# EAGLE design LRTrobo (EAGLE 9.6.1)
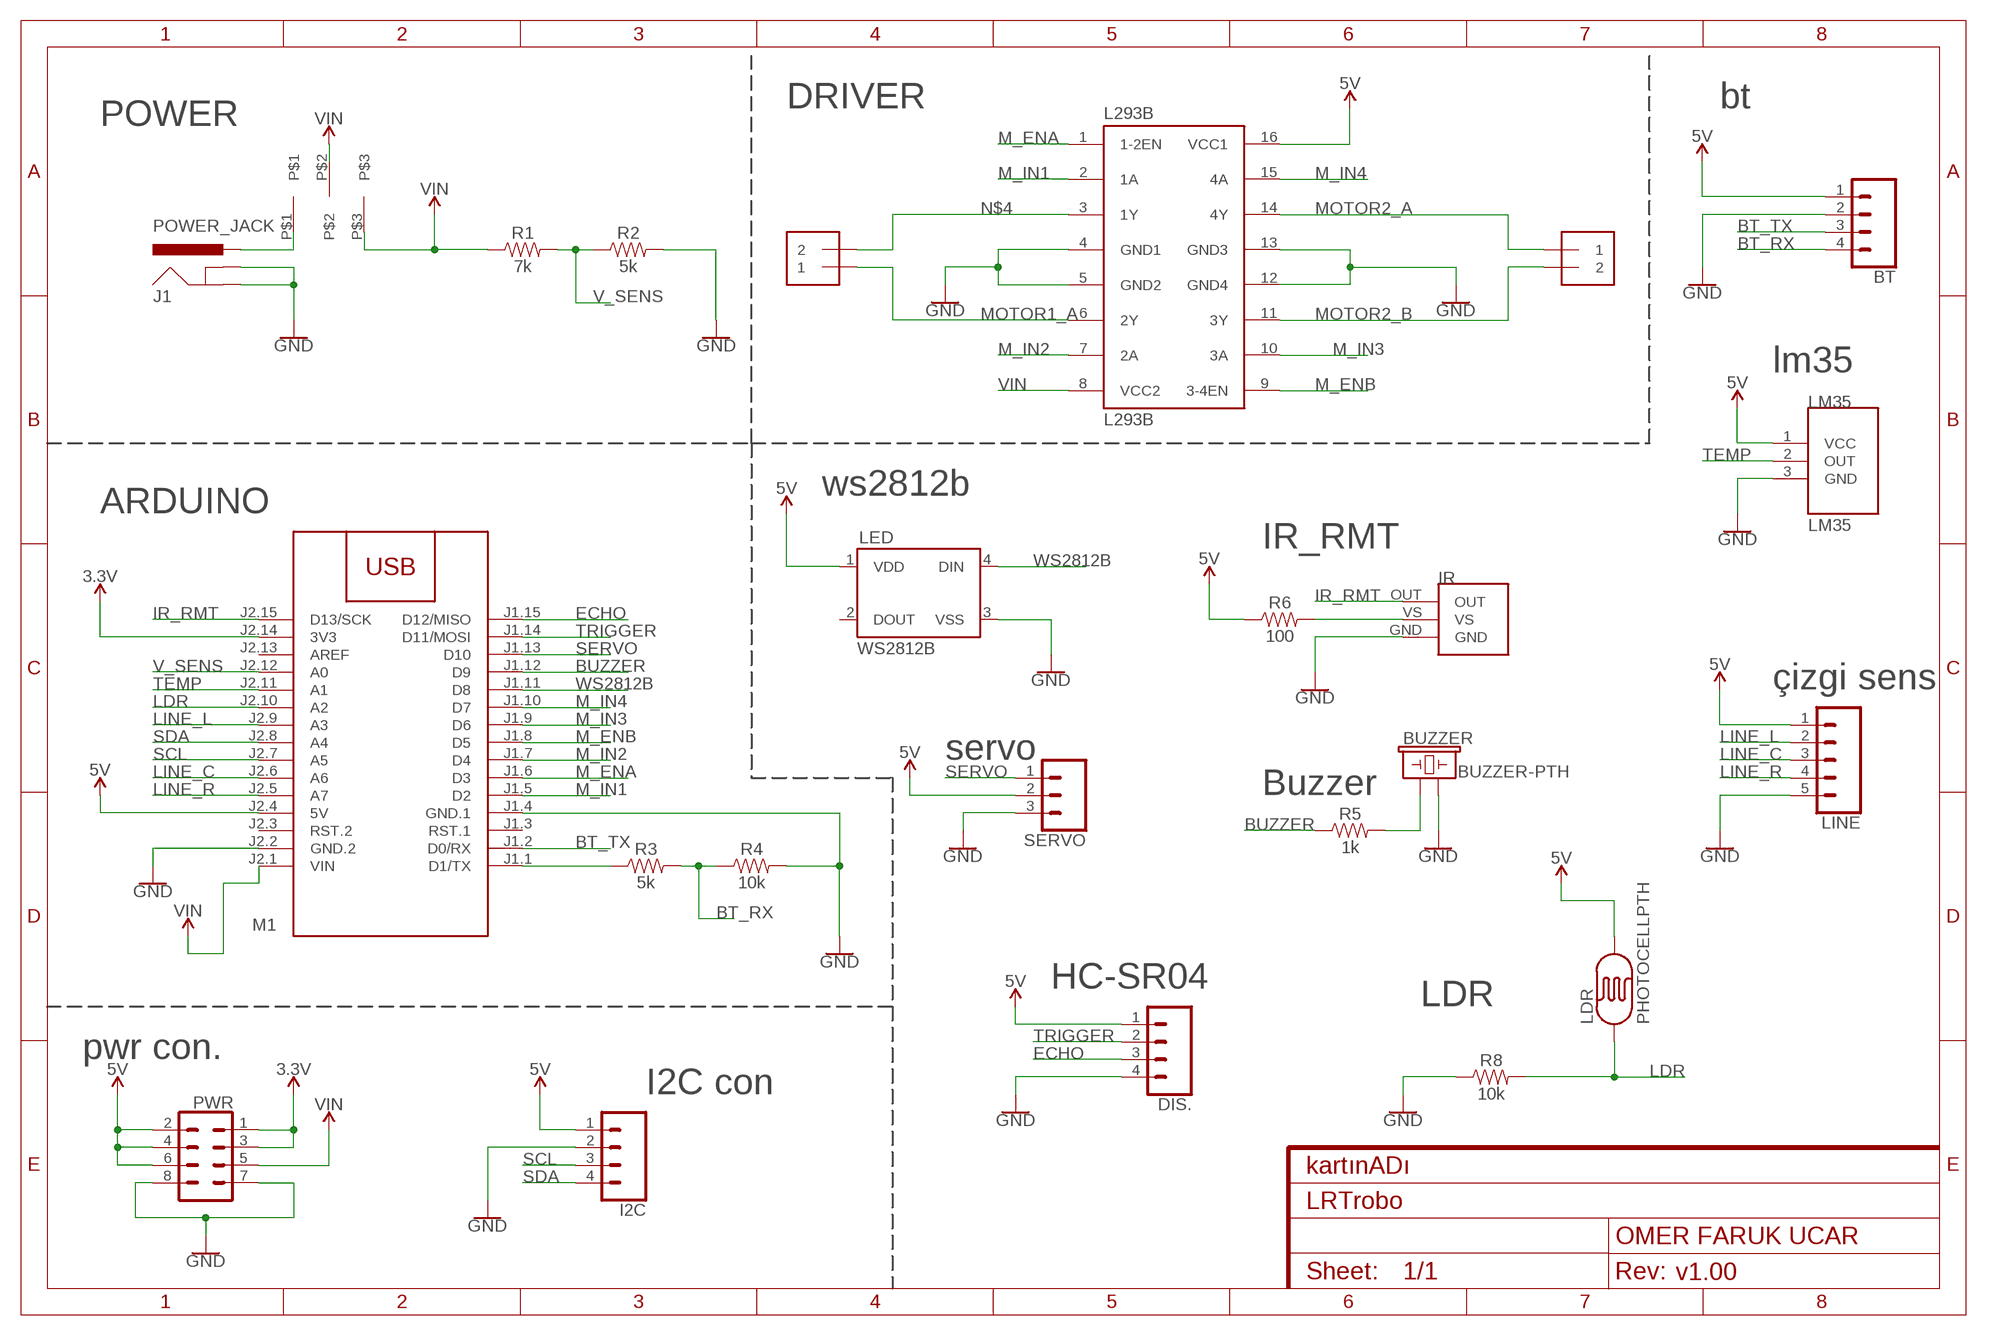
[diagram p0: schematic, sheet 1]
FRAME1 (FRAME-A4L): CNAME: kartınADı; CREVISION: v1.00; DESIGNER: OMER FARUK UCAR

## Parts
BT  CONN_04  [1X04]
BUZZER  BUZZER-PTH  [BUZZER-12MM]
DIS.  CONN_04  [1X04]
I2C  CONN_04  [1X04]
IR  TSOP2238THT  [TSOP2238]
J1  POWER_JACK  [POWER_JACK_PTH]
L293B  L293B  L293D  [DIL16]
LDR  PHOTOCELLPTH  [PHOTOCELL]
LED  WS2812B  [WS2812B]
LINE  CONN_05  [1X05]
LM35  LM35  [TO-92]
M1  ARDUINO-NANO  [ARDUINO-NANO]
MPOWER  1X2-3.5MM  [1X2-3.5MM]
MPOWER1  1X2-3.5MM  [1X2-3.5MM]
PWR  CONN_04X2  [2X4]
R1  7k  1KOHM-HORIZ-1/4W-5%  [AXIAL-0.3]
R2  5k  1KOHM-HORIZ-1/4W-5%  [AXIAL-0.3]
R3  5k  1KOHM-HORIZ-1/4W-5%  [AXIAL-0.3]
R4  10k  1KOHM-HORIZ-1/4W-5%  [AXIAL-0.3]
R5  1k  1KOHM-HORIZ-1/4W-5%  [AXIAL-0.3]
R6  100  1KOHM-HORIZ-1/4W-5%  [AXIAL-0.3]
R8  10k  1KOHM-HORIZ-1/4W-5%  [AXIAL-0.3]
SERVO  CONN_03  [1X03]
SW1  SW1  [SW1]

## Nets
3.3V: M1.J2.14(3V3) PWR.1 PWR.3
5V: BT.1 DIS..1 I2C.1 L293B.16(VCC1) LDR.2 LED.1(VDD) LINE.1 LM35.1(VCC) M1.J2.4(5V) PWR.2 PWR.4 PWR.6 R6.P$1 SERVO.2
BT_RX: BT.4 R3.P$2 R4.P$1
BT_TX: BT.3 M1.J1.2(D0/RX)
BUZZER: M1.J1.12(D9) R5.P$1
ECHO: DIS..3 M1.J1.15(D12/MISO)
GND: BT.2 BUZZER.- DIS..4 I2C.2 IR.GND J1.GND J1.GNDBREAK L293B.4(GND1) L293B.5(GND2) L293B.12(GND4) L293B.13(GND3) LED.3(VSS) LINE.5 LM35.3(GND) M1.J1.4(GND.1) M1.J2.2(GND.2) PWR.7 PWR.8 R2.P$2 R4.P$2 R8.P$1 SERVO.3
IR_RMT: IR.OUT M1.J2.15(D13/SCK)
LDR: LDR.1 M1.J2.10(A2) R8.P$2
LINE_C: LINE.3 M1.J2.6(A6)
LINE_L: LINE.2 M1.J2.9(A3)
LINE_R: LINE.4 M1.J2.5(A7)
M_ENA: L293B.1(1-2EN) M1.J1.6(D3)
M_ENB: L293B.9(3-4EN) M1.J1.8(D5)
M_IN1: L293B.2(1A) M1.J1.5(D2)
M_IN2: L293B.7(2A) M1.J1.7(D4)
M_IN3: L293B.10(3A) M1.J1.9(D6)
M_IN4: L293B.15(4A) M1.J1.10(D7)
MOTOR1_A: L293B.6(2Y) MPOWER.1
MOTOR2_A: L293B.14(4Y) MPOWER1.1
MOTOR2_B: L293B.11(3Y) MPOWER1.2
N$1: M1.J1.1(D1/TX) R3.P$1
N$2: BUZZER.+ R5.P$2
N$3: IR.VS R6.P$2
N$4: L293B.3(1Y) MPOWER.2
N$5: J1.PWR SW1.P$1
SCL: I2C.3 M1.J2.7(A5)
SDA: I2C.4 M1.J2.8(A4)
SERVO: M1.J1.13(D10) SERVO.1
TEMP: LM35.2(OUT) M1.J2.11(A1)
TRIGGER: DIS..2 M1.J1.14(D11/MOSI)
V_SENS: M1.J2.12(A0) R1.P$2 R2.P$1
VIN: L293B.8(VCC2) M1.J2.1(VIN) PWR.5 R1.P$1 SW1.P$2 SW1.P$3
WS2812B: LED.4(DIN) M1.J1.11(D8)
Unconnected: LED.2(DOUT) M1.J1.3(RST.1) M1.J2.3(RST.2) M1.J2.13(AREF)

## Notes on the sheet
- DRIVER | bt
- POWER
- lm35
- ws2812b
- ARDUINO
- IR_RMT
- çizgi sens
- servo
- Buzzer
- HC-SR04
- LDR
- pwr con.
- I2C con

## Library data of the parts
BT DIS. I2C = SparkFun-Connectors:CONN_04: Multi connection point. Often used as Generic Header-pin footprint for 0.1 inch spaced/style header connections On any of the 0.1 inch spaced packages, you can populate with these: Break Away Headers - Straight <https://www.sparkfun.com/products/116> (PRT-00116) Break Away Male Headers - Right Angle <https://www.sparkfun.com/products/553> (PRT-00553) Female Headers <https://www.sparkfun.com/products/115> (PRT-00115) Break Away Headers - Machine Pin <https://www.sparkfun.com/products/117> (PRT-00117) Break Away Female Headers - Swiss Machine Pin <https://www.sparkfun.com/products/743> (PRT-00743) For SCREWTERMINALS and SPRING TERMINALS visit here: Screw Terimnals on SparkFun.com <https://www.sparkfun.com/search/results?term=Screw+Terminals> (5mm/3.5mm/2.54mm spacing) This device is also useful as a general connection point to wire up your design to another part of your project. Our various solder wires solder well into these plated through hole pads. Hook-Up Wire - Assortment (Stranded, 22 AWG) <https://www.sparkfun.com/products/11375> (PRT-11375) Hook-Up Wire - Assortment (Solid Core, 22 AWG) <https://www.sparkfun.com/products/11367> (PRT-11367) View the entire wire category on our website here <https://www.sparkfun.com/categories/141> Special notes: Molex polarized connector foot print use with SKU : PRT-08231 with associated crimp pins and housings. 1MM SMD Version SKU: PRT-10208; PROD_ID: CONN-09696
BUZZER = SparkFun-Electromechanical:BUZZER: Buzzer Small round buzzers that operate around the audible 2kHz range. You can use these as speakers to create simple music or user interfaces. Variant Overview: PTH - Mini Speaker - PC Mount 12mm 2.048kHz <https://www.sparkfun.com/products/7950> PTH_KIT - Mini Speaker - PC Mount 12mm 2.048kHz <https://www.sparkfun.com/products/7950> KIT simplifies soldering by adding stop mask to one side of the pads. PTH_NO_SILK - Mini Speaker - PC Mount 12mm 2.048kHz <https://www.sparkfun.com/products/7950> No silkscreen indicator of buzzer outline. PTH_KIT_NO_SILK - Mini Speaker - PC Mount 12mm 2.048kHz <https://www.sparkfun.com/products/7950> KIT package w/o silkscreen SMD - Buzzer Audio Magnetic (CCV-084B16) SMD buzzer used on, e.g. the LilyPad Buzzer <https://www.sparkfun.com/products/8463> and RFID USB Reader <https://www.sparkfun.com/products/9963>. SMD_KIT - Buzzer Audio Magnetic (CCV-084B16) SMD Buzzer with elongated pins to make soldering easier. Used on the SparkFun Simon Says - Surface Mount Soldering Kit <https://www.sparkfun.com/products/10935>.; PROD_ID: COMP-08253; SF_SKU: COM-07950
IR = OmerFarukUcar-Sensors:TSOP2238: TSOP2238 Device Created Date: 12.02.2020 Datasheet: https://cdn.ozdisan.com/ETicaret_Dosya/38875_1350615.pdf
J1 = SparkFun-Connectors:POWER_JACK: Power Jack Connector This is the standard 5.5mm barrel jack for power. The PTH is the most common, proven, reliable, footprint. The Slot footprint only works if the mill layer is transmitted to the PCB fab house so be warned. Here are the connectors we sell at SparkFun: DC Barrel Power Jack/Connector <https://www.sparkfun.com/products/119> (PRT-00119) DC Barrel Power Jack/Connector (SMD) <https://www.sparkfun.com/products/12748> (PRT-12748) DC Barrel Jack Adapter - Breadboard Compatible <https://www.sparkfun.com/products/10811> (PRT-10811) It is used on this SparkFun product (and many, many others): SparkFun RedBoard - Programmed with Arduino <https://www.sparkfun.com/products/12757> (DEV-12757) Also, if you need a mating power supply or connector, please check these out: Wall Adapter Power Supply - 9VDC 650mA <https://www.sparkfun.com/products/298> (TOL-00298) DC Barrel Jack Adapter - Male <https://www.sparkfun.com/products/10287> (PRT-10287); PROD_ID: CONN-08197
L293B = st-microelectronics:L293D: PUSH-PULL 4 CHANNEL DRIVER; MPN: L293D; OC_FARNELL: 9589619; OC_NEWARK: 56P8249
LDR = SparkFun:PHOTOCELL: Photocell Also known as a CdS photoresistor. This is a low cost way to detect light levels. Resistance decreases with more incoming light. SparkFun SKU: SEN-09088
LED = SparkFun-LED:WS2812B: WS2812B - Intelligent control LED integrated light source Technical Specifications: Power Supply Voltage (VDD): 3.5 to 5.3 V Input Voltage (VI): -0.5 to VDD+0.5 V Operating Junction Temperature (Topt): -25°C to +80°C Storage Temperature Range (Tstg): -55°C to +150°C; PROD_ID: DIO-12503
LINE = SparkFun-Connectors:CONN_05: Multi connection point. Often used as Generic Header-pin footprint for 0.1 inch spaced/style header connections On any of the 0.1 inch spaced packages, you can populate with these: Break Away Headers - Straight <https://www.sparkfun.com/products/116> (PRT-00116) Break Away Male Headers - Right Angle <https://www.sparkfun.com/products/553> (PRT-00553) Female Headers <https://www.sparkfun.com/products/115> (PRT-00115) Break Away Headers - Machine Pin <https://www.sparkfun.com/products/117> (PRT-00117) Break Away Female Headers - Swiss Machine Pin <https://www.sparkfun.com/products/743> (PRT-00743) For SCREWTERMINALS and SPRING TERMINALS visit here: Screw Terimnals on SparkFun.com <https://www.sparkfun.com/search/results?term=Screw+Terminals> (5mm/3.5mm/2.54mm spacing) This device is also useful as a general connection point to wire up your design to another part of your project. Our various solder wires solder well into these plated through hole pads. Hook-Up Wire - Assortment (Stranded, 22 AWG) <https://www.sparkfun.com/products/11375> (PRT-11375) Hook-Up Wire - Assortment (Solid Core, 22 AWG) <https://www.sparkfun.com/products/11367> (PRT-11367) View the entire wire category on our website here <https://www.sparkfun.com/categories/141> Special notes: Molex polarized connector foot print use with SKU : PRT-08231 with associated crimp pins and housings. 1MM SMD Version SKU: PRT-10208
LM35 = LezzetliRobotTarifleriLib:LM35
M1 = OmerFaruk-CPUBoards:ARDUINO-NANO: Arduino Nano 3.0
MPOWER MPOWER1 = adafruit:1X2: 3.5mm Terminal block http://www.ladyada.net/library/pcb/eaglelibrary.html
PWR = SparkFun-Connectors:CONN_04X2: Multi connection point. Often used as Generic Header-pin footprint for 0.1 inch spaced/style header connections On any of the 0.1 inch spaced packages, you can populate with these: Break Away Headers - Straight <https://www.sparkfun.com/products/116> (PRT-00116) Break Away Male Headers - Right Angle <https://www.sparkfun.com/products/553> (PRT-00553) Female Headers <https://www.sparkfun.com/products/115> (PRT-00115) Break Away Headers - Machine Pin <https://www.sparkfun.com/products/117> (PRT-00117) Break Away Female Headers - Swiss Machine Pin <https://www.sparkfun.com/products/743> (PRT-00743)
R1-R4 R6 R8 = SparkFun-Resistors:1KOHM: 1kΩ resistor A resistor is a passive two-terminal electrical component that implements electrical resistance as a circuit element. Resistors act to reduce current flow, and, at the same time, act to lower voltage levels within circuits. - Wikipedia; PROD_ID: RES-08380; VALUE: 1k
R5 = SparkFun-Resistors:1KOHM: 1kΩ resistor A resistor is a passive two-terminal electrical component that implements electrical resistance as a circuit element. Resistors act to reduce current flow, and, at the same time, act to lower voltage levels within circuits. - Wikipedia; PROD_ID: RES-08380
SERVO = SparkFun-Connectors:CONN_03: Multi connection point. Often used as Generic Header-pin footprint for 0.1 inch spaced/style header connections On any of the 0.1 inch spaced packages, you can populate with these: Break Away Headers - Straight <https://www.sparkfun.com/products/116> (PRT-00116) Break Away Male Headers - Right Angle <https://www.sparkfun.com/products/553> (PRT-00553) Female Headers <https://www.sparkfun.com/products/115> (PRT-00115) Break Away Headers - Machine Pin <https://www.sparkfun.com/products/117> (PRT-00117) Break Away Female Headers - Swiss Machine Pin <https://www.sparkfun.com/products/743> (PRT-00743) Stackable Header - 3 Pin (Female, 0.1") <https://www.sparkfun.com/products/13875> (PRT-13875) For SCREWTERMINALS and SPRING TERMINALS visit here: Screw Terimnals on SparkFun.com <https://www.sparkfun.com/search/results?term=Screw+Terminals> (5mm/3.5mm/2.54mm spacing) This device is also useful as a general connection point to wire up your design to another part of your project. Our various solder wires solder well into these plated through hole pads. Hook-Up Wire - Assortment (Stranded, 22 AWG) <https://www.sparkfun.com/products/11375> (PRT-11375) Hook-Up Wire - Assortment (Solid Core, 22 AWG) <https://www.sparkfun.com/products/11367> (PRT-11367) View the entire wire category on our website here <https://www.sparkfun.com/categories/141> Special notes: Molex polarized connector foot print use with SKU : PRT-08232 with associated crimp pins and housings.
SW1 = LezzetliRobotTarifleriLib:SW1

## Board
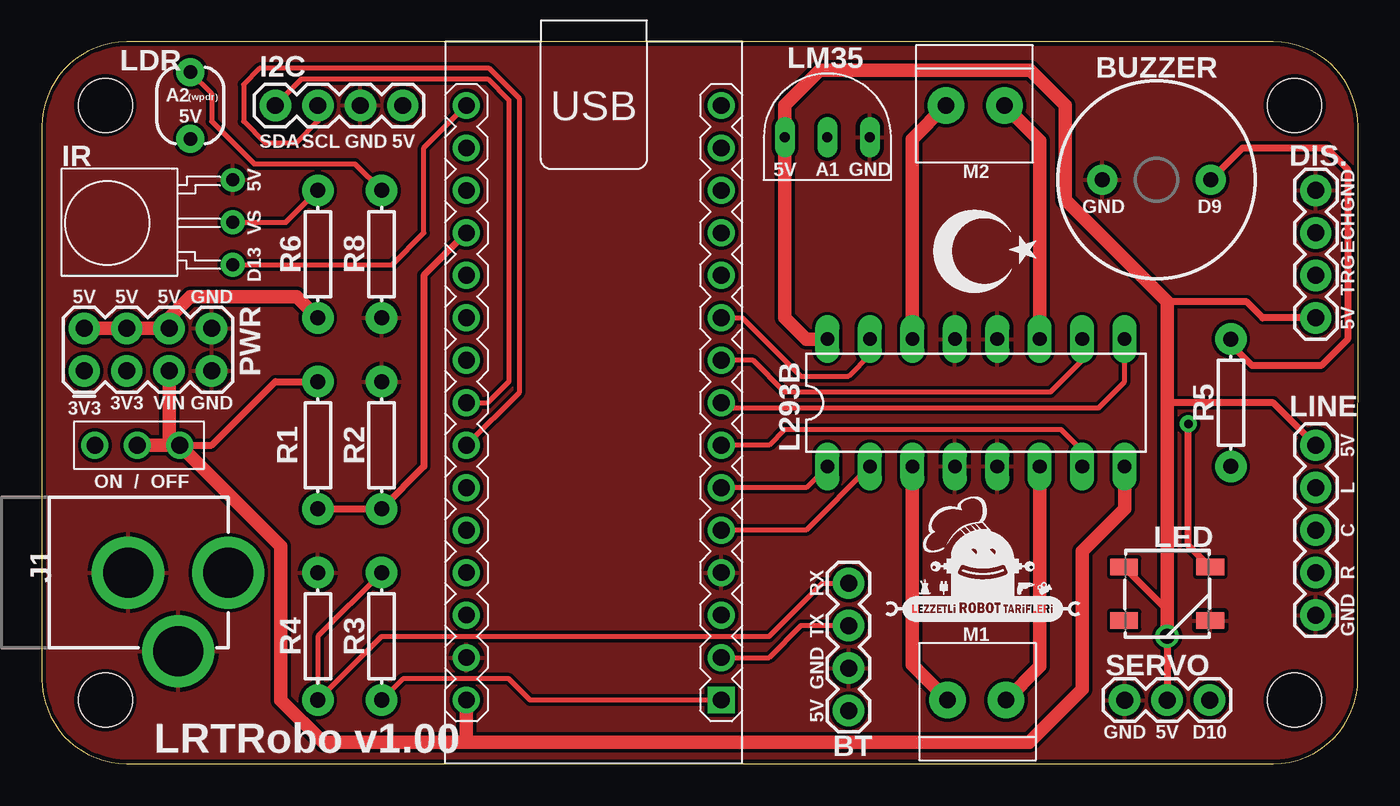
[diagram p1: board, top side]
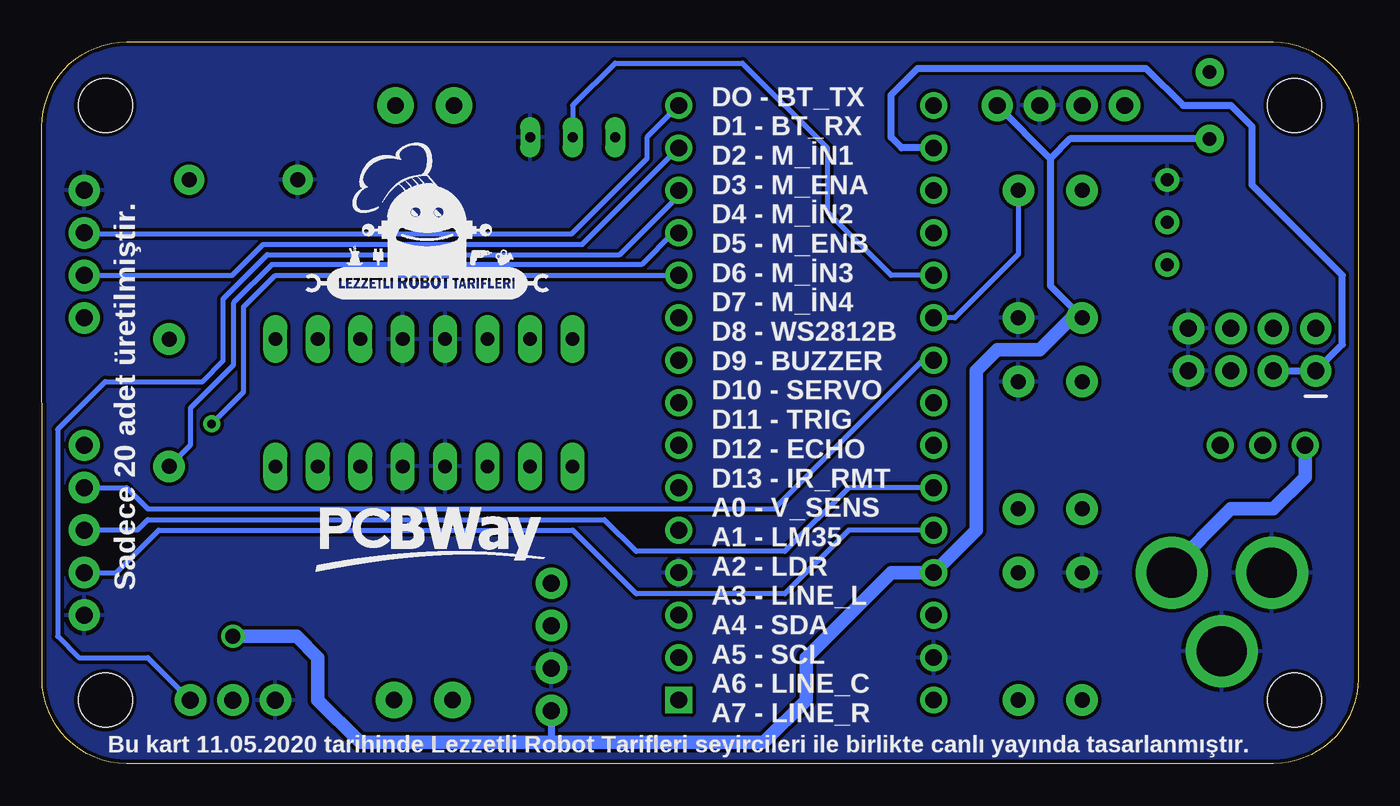
[diagram p2: board, bottom side, seen from below]

Size 78.74 x 43.18 mm. Coordinates in mm from the lower left corner, seen from the top.
Outline: 73.66,43.18 5.08,43.18 arc90 0,38.1 0,5.08 arc90 5.08,0 73.64,0 arc90 78.72,5.08 78.74,38.09 arc90 73.66,43.18
Copper layers (1*16): Top 0.035mm / dielectric 1.5mm / Bottom 0.035mm
Design rules "SparkFun": minimum track width 8mil, minimum drill 20mil, track to track 8mil, track to pad 8mil, pad to pad 8mil, via to via 8mil, smd to smd 8mil, copper to edge 10mil, drill to drill 8mil, minimum pad ring 12mil, minimum via ring 10mil, stop-mask expansion 4mil, vias tented up to drill 25mil, thermal gap 10mil
Holes 3.2 mm at 74.93,39.37 74.93,3.81 3.81,39.37 3.81,3.81

### Footprints (pad centres in the part's own frame; a part is rotated, then mirrored left to right if it is on the bottom)
1X04 = drill 1.016 pad 1.88: 1 0,0; 2 2.54,0; 3 5.08,0; 4 7.62,0
BUZZER-12MM = drill 0.9 pad 1.778: + 3.25,0; - -3.25,0
TSOP2238 = drill 0.8: GND 2.54,-7.61; OUT -2.54,-7.61; VS 0,-7.61
POWER_JACK_PTH = drill 2.997 pad 4.318: GND 0,7.7; GNDBREAK 4.7,10.7; PWR 0,13.7
DIL16 = drill 0.813 long: 1 -8.89,-3.81; 2 -6.35,-3.81; 3 -3.81,-3.81; 4 -1.27,-3.81; 5 1.27,-3.81; 6 3.81,-3.81; 7 6.35,-3.81; 8 8.89,-3.81; 9 8.89,3.81; 10 6.35,3.81; 11 3.81,3.81; 12 1.27,3.81; 13 -1.27,3.81; 14 -3.81,3.81; 15 -6.35,3.81; 16 -8.89,3.81
PHOTOCELL = drill 0.8 pad 1.676: 1 -2,0; 2 2,0
WS2812B = smd 1.651 x 1: 1 -2.577,1.6; 2 -2.577,-1.6; 3 2.577,-1.6; 4 2.577,1.6
1X05 = drill 1.016 pad 1.88: 1 0,0; 2 2.54,0; 3 5.08,0; 4 7.62,0; 5 10.16,0
TO-92 = drill 0.6 long: 1 -1.27,0; 2 1.27,0; 3 3.81,0
ARDUINO-NANO = drill 1 square: J1.1 17.78,7.62 | drill 1: J1.2 15.24,7.62; J1.3 12.7,7.62; J1.4 10.16,7.62; J1.5 7.62,7.62; J1.6 5.08,7.62; J1.7 2.54,7.62; J1.8 0,7.62; J1.9 -2.54,7.62; J1.10 -5.08,7.62; J1.11 -7.62,7.62; J1.12 -10.16,7.62; J1.13 -12.7,7.62; J1.14 -15.24,7.62; J1.15 -17.78,7.62; J2.1 17.78,-7.62; J2.2 15.24,-7.62; J2.3 12.7,-7.62; J2.4 10.16,-7.62; J2.5 7.62,-7.62; J2.6 5.08,-7.62; J2.7 2.54,-7.62; J2.8 0,-7.62; J2.9 -2.54,-7.62; J2.10 -5.08,-7.62; J2.11 -7.62,-7.62; J2.12 -10.16,-7.62; J2.13 -12.7,-7.62; J2.14 -15.24,-7.62; J2.15 -17.78,-7.62
1X2-3.5MM = drill 1 pad 2.184: 1 1.8,0; 2 -1.7,0
2X4 = drill 1.016 pad 1.88: 1 -3.81,-1.27; 2 -3.81,1.27; 3 -1.27,-1.27; 4 -1.27,1.27; 5 1.27,-1.27; 6 1.27,1.27; 7 3.81,-1.27; 8 3.81,1.27
AXIAL-0.3 = drill 0.9 pad 1.88: P$1 -3.81,0; P$2 3.81,0
1X03 = drill 1.016 pad 1.88: 1 0,0; 2 2.54,0; 3 5.08,0
SW1 = drill 1: P$1 -2.54,0; P$2 0,0; P$3 2.54,0

### Placement (x,y rotation side)
BT  48.26,3.17 90 top
BUZZER  66.67,34.92 0 top
DIS.  76.2,26.67 90 top
I2C  21.59,39.37 180 top
IR  3.81,32.38 90 top
J1  -2.54,11.43 270 top
L293B  55.88,21.59 0 top
LDR  8.89,39.37 270 top
LED  67.31,10.16 0 top
LINE  76.2,19.05 270 top
LM35  45.72,37.46 0 top
M1  33.02,21.59 270 top
MPOWER  55.88,3.81 0 top
MPOWER1  55.88,39.37 180 top
PWR  6.35,24.77 0 top
R1  16.51,19.05 270 top
R2  20.32,19.05 90 top
R3  20.32,7.62 90 top
R4  16.51,7.62 90 top
R5  71.12,21.59 90 top
R6  16.51,30.48 90 top
R8  20.32,30.48 90 top
SERVO  69.85,3.81 180 top
SW1  5.72,19.05 0 top
U$1  [LRT-LOGO-0,0125-B]  55.82,27.25 0 bottom
U$2  [LOGO0.001]  50.49,8.49 0 top
U$3  [PCBWAY_LOGO_0.01]  63.08,8.1 0 bottom
U$5  [TR_MINI]  52.14,27.61 0 top

### Tracks (layer width: path | path; a pad name or v marks a point on that pad's centre or on a via)
3.3V
  Bottom 0.406: M1.J2.14 27.3,36.83 27.94,37.46 27.94,40 26.35,41.59 12.7,41.59 10.48,39.37 7.62,39.37 6.35,38.1 6.35,34.61 0.95,29.21 0.95,25.08 PWR.1 PWR.3
5V  (via drill 0.89)
  Top 0.406: SERVO.2 v67.31,7.62 67.31,9.18 LED.1 | LINE.1 73.66,21.59 67.31,21.59 | DIS..1 73.03,26.67 72.07,27.62 67.31,27.62
  Top 0.813: v67.31,7.62 67.31,21.59 67.31,27.62 61.21,33.72 61.21,39.37 59.12,41.47 46.55,41.47 44.45,39.37 LM35.1 44.45,26.67 45.72,25.4 L293B.16 | PWR.2 PWR.4 PWR.6 7.62,26.67 8.89,27.94 15.24,27.94 R6.P$1
  Bottom 0.406: BT.1 48.26,1.27 | I2C.1 18.41,36.19 | 18.41,36.19 18.41,28.57 R6.P$1 | 18.41,36.19 17.24,37.37 LDR.2
  Bottom 0.813: R6.P$1 17.14,26.67 19.05,24.77 21.59,24.77 22.86,23.49 22.86,13.97 M1.J2.4 27.94,11.43 33.02,6.35 33.02,3.81 35.56,1.27 48.26,1.27 59.69,1.27 62.23,3.81 62.23,6.35 63.5,7.62 v67.31,7.62
BT_RX
  Top 0.305: R3.P$2 16.51,7.62 R4.P$1 20.32,7.62 43.5,7.62 46.67,10.79 BT.4
BT_TX
  Top 0.305: M1.J1.2 43.5,6.35 45.4,8.25 BT.3
BUZZER
  Bottom 0.305: R5.P$1 69.85,19.05 69.85,21.27 67.28,23.84 67.28,27.56 65,29.84 42.86,29.84 40.96,31.75 M1.J1.12
ECHO
  Bottom 0.305: DIS..3 76.12,31.67 47.07,31.67 42.55,36.19 42.55,37.46 M1.J1.15
GND
  pour Top: -2.54,45.72 -2.54,-2.54 81.28,-2.54 81.28,45.72
  pour Bottom: -5.08,48.26 -5.08,-5.08 85.09,-5.08 85.09,48.26
IR_RMT
  Top 0.305: IR.OUT 20.96,29.84 22.86,31.75 22.86,36.83 M1.J2.15
LDR
  Top 0.305: LDR.1 10.16,40.1 10.16,38.42 12.7,35.88 18.73,35.88 R8.P$2
  Bottom 0.305: R8.P$2 20.32,30.48 24.13,26.67 M1.J2.10
LINE_C
  Bottom 0.305: LINE.3 73.03,13.97 72.39,14.6 45.09,14.6 43.18,12.7 34.29,12.7 30.48,16.51 M1.J2.6
LINE_L
  Bottom 0.305: LINE.2 73.66,16.51 72.39,15.24 34.92,15.24 26.04,24.13 M1.J2.9
LINE_R
  Bottom 0.305: LINE.4 74.3,11.43 71.75,13.97 46.99,13.97 43.18,10.16 34.29,10.16 30.48,13.97 M1.J2.5
M_ENA
  Top 0.305: L293B.1 45.72,16.51 M1.J1.6
M_ENB
  Top 0.305: M1.J1.8 40.96,21.27 63.18,21.27 64.77,22.86 L293B.9
M_IN1
  Top 0.305: L293B.2 45.72,13.97 M1.J1.5
M_IN2
  Top 0.305: M1.J1.7 43.5,19.05 44.45,20 60.96,20 62.23,18.73 L293B.7
M_IN3
  Top 0.305: L293B.10 62.23,24.13 60.33,22.22 44.45,22.22 42.55,24.13 M1.J1.9
M_IN4
  Top 0.305: M1.J1.10 41.91,26.67 45.4,23.18 48.26,23.18 49.53,24.45 L293B.15
MOTOR1_A
  Top 0.813: L293B.6 59.69,5.82 MPOWER.1
MOTOR2_A
  Top 0.813: L293B.14 52.07,37.36 MPOWER1.1
MOTOR2_B
  Top 0.813: L293B.11 59.69,37.26 MPOWER1.2
N$1
  Top 0.305: M1.J1.1 29.21,3.81 27.94,5.08 21.59,5.08 R3.P$1
N$2
  Top 0.406: BUZZER.+ 71.83,36.83 76.84,36.83 78.11,35.56 78.11,25.4 76.52,23.81 72.39,23.81 71.12,25.08 R5.P$2
N$3
  Top 0.305: IR.VS 14.61,32.38 R6.P$2
N$4
  Top 0.813: MPOWER.2 52.07,5.92 L293B.3
N$5
  Bottom 0.813: SW1.P$1 3.17,17.14 5.08,15.24 7.62,15.24 11.16,11.7 J1.PWR
SCL
  Top 0.305: M1.J2.7 28.58,22.22 28.58,39.77 26.75,41.59 13.02,41.59 12.07,40.64 12.07,38.42 13.34,37.15 15.24,37.15 16.51,38.42 I2C.3
SDA
  Top 0.305: M1.J2.8 26.67,21.59 27.94,22.86 27.94,39.69 26.67,40.96 15.56,40.96 I2C.4
SERVO
  Bottom 0.305: SERVO.1 72.39,6.35 76.52,6.35 77.79,7.62 77.79,20 74.93,22.86 69.12,22.86 67.89,24.09 67.89,27.81 65.25,30.45 44.16,30.45 40.64,33.97 M1.J1.13
TEMP
  Bottom 0.305: M1.J2.11 27.94,29.21 31.75,33.02 31.75,36.83 36.83,41.91 44.45,41.91 46.99,39.37 LM35.2
TRIGGER
  Bottom 0.305: DIS..2 67.36,29.21 65.5,31.06 46.41,31.06 M1.J1.14
V_SENS
  Top 0.406: R1.P$2 R2.P$1 22.86,17.78 22.86,29.21 M1.J2.12
VIN
  Top 0.406: SW1.P$3 10.16,19.05 13.97,22.86 R1.P$1
  Top 0.813: SW1.P$3 7.62,19.05 PWR.5 | SW1.P$3 14.29,13.02 14.29,3.81 16.83,1.27 25.4,1.27 | L293B.8 64.77,15.24 62.23,12.7 62.23,4.45 59.05,1.27 25.4,1.27 | M1.J2.1 25.4,1.27 | SW1.P$2 SW1.P$3
WS2812B  (via drill 0.51)
  Top 0.406: LED.4 68.58,13.07 v68.58,20.32
  Bottom 0.305: v68.58,20.32 66.67,22.22 66.67,27.3 64.77,29.21 M1.J1.11

### Text on the board
tPlace: A2 | (wpdr) | 5V | SDA | SCL | GND | 5V | 5V | A1 | GND | M2 | 5V | GND | GND | D9 | VS | ECH | D13 | TRG | 5V | 5V | 5V | GND | 5V | 3V3 | 3V3 | VIN | GND | 5V | ON / OFF | L | C | R | RX | TX | GND | M1 | GND | 5V | GND | 5V | D10 | LRTRobo v1.00
bPlace: DO - BT_TX / D1 - BT_RX / D2 - M_İN1 / D3 - M_ENA / D4 - M_İN2 / D5 - M_ENB / D6 - M_İN3 / D7 - M_İN4 / D8 - WS2812B / D9 - BUZZER / D10 - SERVO / D11 - TRIG / D12 - ECHO / D13 - IR_RMT / A0 - V_SENS / A1 - LM35 / A2 - LDR / A3 - LINE_L / A4 - SDA / A5 - SCL / A6 - LINE_C / A7 - LINE_R | Sadece 20 adet üretilmiştir. | Bu kart 11.05.2020 tarihinde Lezzetli Robot Tarifleri seyircileri ile birlikte canlı yayında tasarlanmıştır.